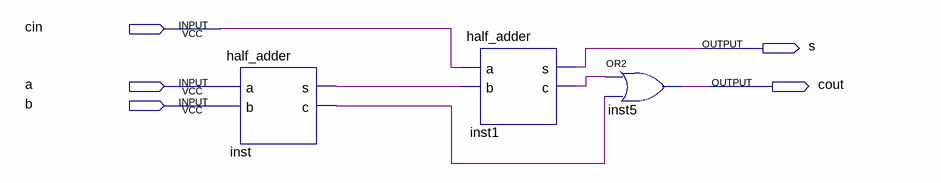
[diagram p0: schematic sheet]
// Quartus schematic full_adder.bdf as structural Verilog: 3 symbols, 5 pins
module full_adder (
  input  cin,
  input  a,
  input  b,
  output s,
  output cout
);

  wire inst1_c, inst_c, inst_s;

  half_adder inst (.a(a), .b(b), .s(inst_s), .c(inst_c));
  half_adder inst1 (.a(cin), .b(inst_s), .s(s), .c(inst1_c));
  or inst5 (cout, inst1_c, inst_c);
endmodule
